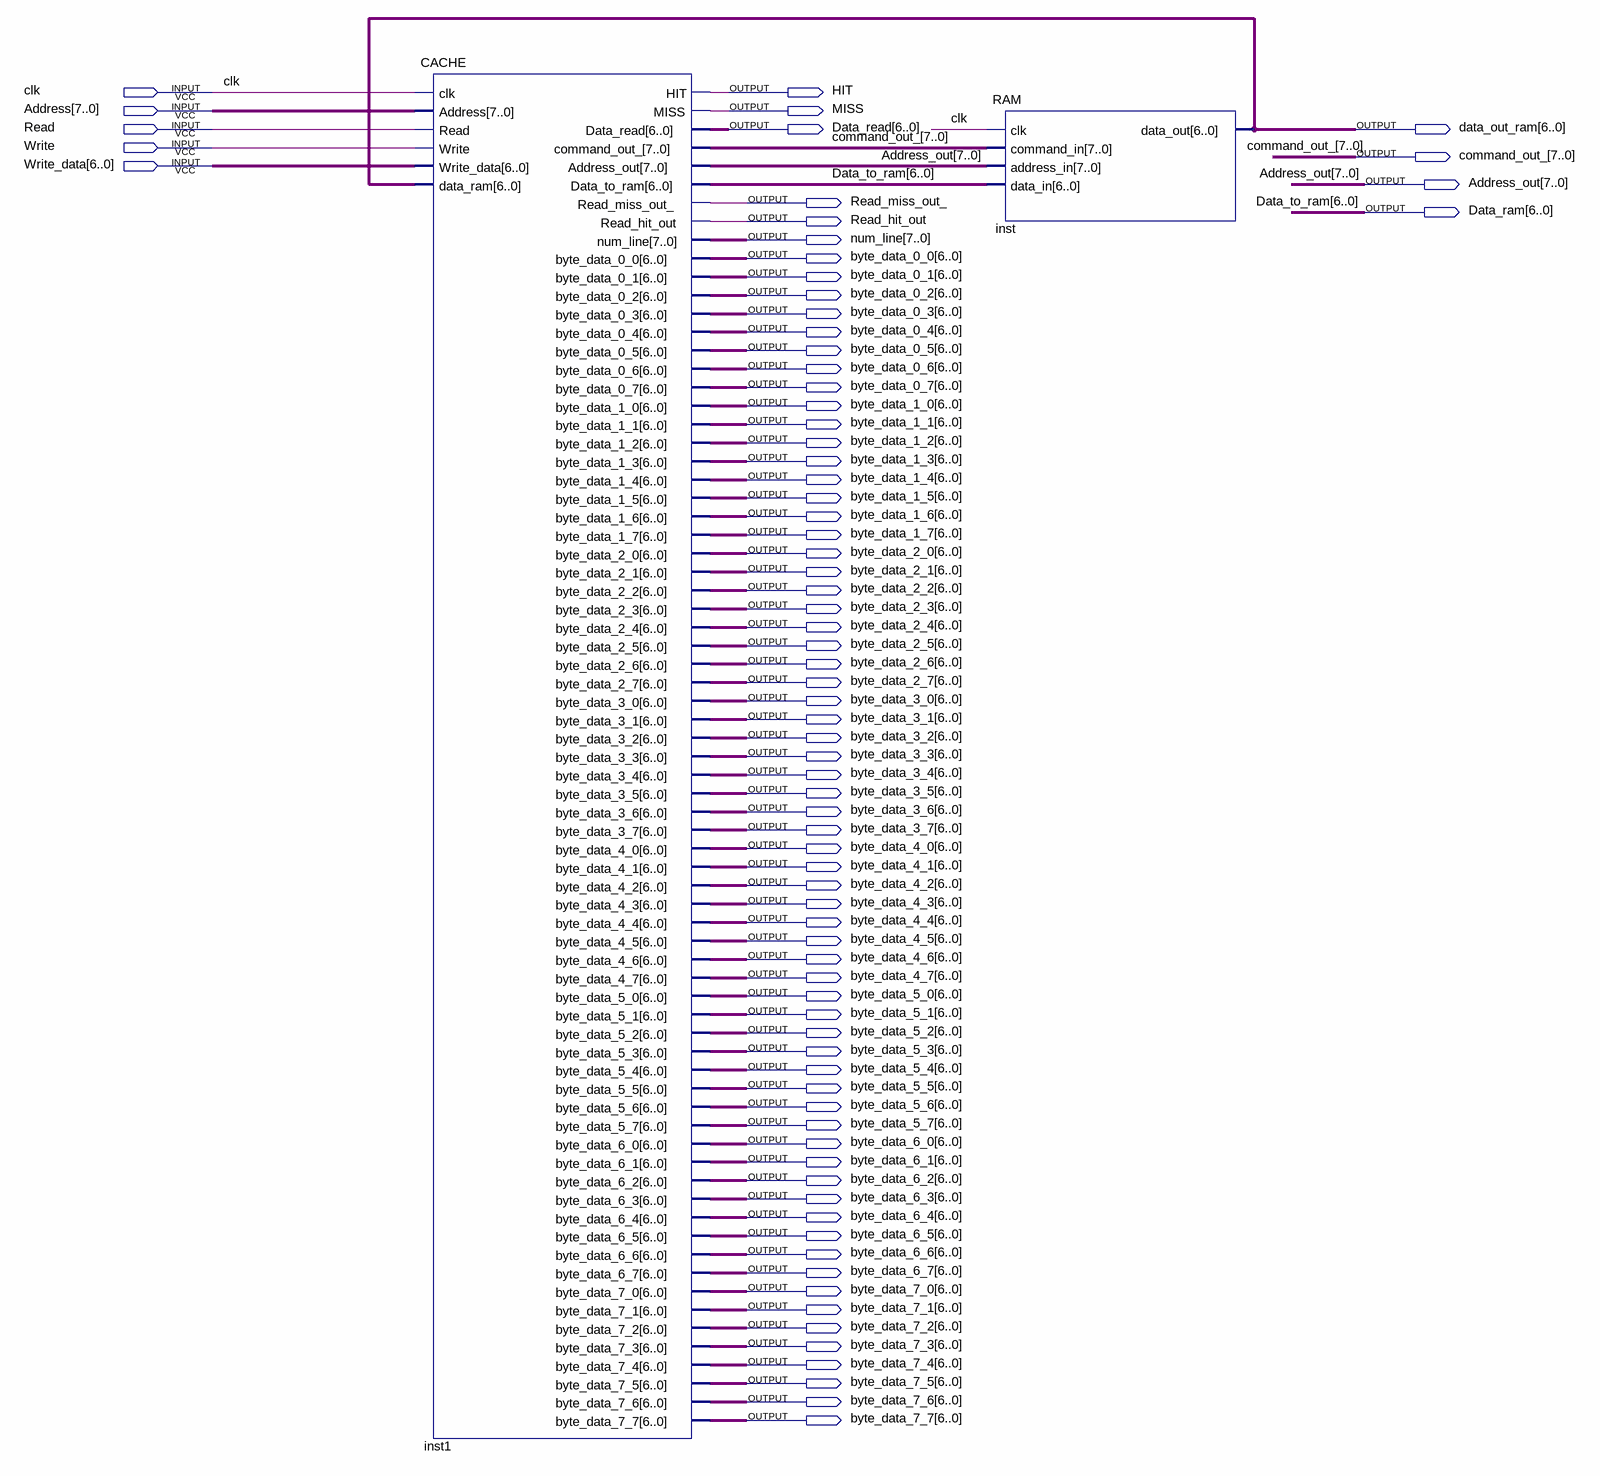
[diagram p0: schematic sheet]
// Quartus schematic lab8.bdf as structural Verilog: 2 symbols, 79 pins
module lab8 (
  input  clk,
  input  [7:0] Address,
  input  Read,
  input  Write,
  input  [6:0] Write_data,
  output HIT,
  output MISS,
  output [6:0] Data_read,
  output [6:0] data_out_ram,
  output [7:0] command_out_,
  output [7:0] Address_out,
  output Read_miss_out_,
  output [6:0] Data_ram,
  output Read_hit_out,
  output [7:0] num_line,
  output [6:0] byte_data_0_0,
  output [6:0] byte_data_0_1,
  output [6:0] byte_data_0_2,
  output [6:0] byte_data_0_3,
  output [6:0] byte_data_0_4,
  output [6:0] byte_data_0_5,
  output [6:0] byte_data_0_6,
  output [6:0] byte_data_0_7,
  output [6:0] byte_data_1_0,
  output [6:0] byte_data_1_1,
  output [6:0] byte_data_1_2,
  output [6:0] byte_data_1_3,
  output [6:0] byte_data_1_4,
  output [6:0] byte_data_1_5,
  output [6:0] byte_data_1_6,
  output [6:0] byte_data_1_7,
  output [6:0] byte_data_2_0,
  output [6:0] byte_data_2_1,
  output [6:0] byte_data_2_2,
  output [6:0] byte_data_2_3,
  output [6:0] byte_data_2_4,
  output [6:0] byte_data_2_5,
  output [6:0] byte_data_2_6,
  output [6:0] byte_data_2_7,
  output [6:0] byte_data_3_0,
  output [6:0] byte_data_3_1,
  output [6:0] byte_data_3_2,
  output [6:0] byte_data_3_3,
  output [6:0] byte_data_3_4,
  output [6:0] byte_data_3_5,
  output [6:0] byte_data_3_6,
  output [6:0] byte_data_3_7,
  output [6:0] byte_data_4_0,
  output [6:0] byte_data_4_1,
  output [6:0] byte_data_4_2,
  output [6:0] byte_data_4_3,
  output [6:0] byte_data_4_4,
  output [6:0] byte_data_4_5,
  output [6:0] byte_data_4_6,
  output [6:0] byte_data_4_7,
  output [6:0] byte_data_5_0,
  output [6:0] byte_data_5_1,
  output [6:0] byte_data_5_2,
  output [6:0] byte_data_5_3,
  output [6:0] byte_data_5_4,
  output [6:0] byte_data_5_5,
  output [6:0] byte_data_5_6,
  output [6:0] byte_data_5_7,
  output [6:0] byte_data_6_0,
  output [6:0] byte_data_6_1,
  output [6:0] byte_data_6_2,
  output [6:0] byte_data_6_3,
  output [6:0] byte_data_6_4,
  output [6:0] byte_data_6_5,
  output [6:0] byte_data_6_6,
  output [6:0] byte_data_6_7,
  output [6:0] byte_data_7_0,
  output [6:0] byte_data_7_1,
  output [6:0] byte_data_7_2,
  output [6:0] byte_data_7_3,
  output [6:0] byte_data_7_4,
  output [6:0] byte_data_7_5,
  output [6:0] byte_data_7_6,
  output [6:0] byte_data_7_7
);

  CACHE inst1 (
    .clk(clk), .Address(Address), .Read(Read), .Write(Write), .Write_data(Write_data),
    .data_ram(data_out_ram), .HIT(HIT), .MISS(MISS), .Data_read(Data_read), .command_out_(command_out_),
    .Address_out(Address_out), .Data_to_ram(Data_ram), .Read_miss_out_(Read_miss_out_),
    .Read_hit_out(Read_hit_out), .num_line(num_line), .byte_data_0_0(byte_data_0_0),
    .byte_data_0_1(byte_data_0_1), .byte_data_0_2(byte_data_0_2), .byte_data_0_3(byte_data_0_3),
    .byte_data_0_4(byte_data_0_4), .byte_data_0_5(byte_data_0_5), .byte_data_0_6(byte_data_0_6),
    .byte_data_0_7(byte_data_0_7), .byte_data_1_0(byte_data_1_0), .byte_data_1_1(byte_data_1_1),
    .byte_data_1_2(byte_data_1_2), .byte_data_1_3(byte_data_1_3), .byte_data_1_4(byte_data_1_4),
    .byte_data_1_5(byte_data_1_5), .byte_data_1_6(byte_data_1_6), .byte_data_1_7(byte_data_1_7),
    .byte_data_2_0(byte_data_2_0), .byte_data_2_1(byte_data_2_1), .byte_data_2_2(byte_data_2_2),
    .byte_data_2_3(byte_data_2_3), .byte_data_2_4(byte_data_2_4), .byte_data_2_5(byte_data_2_5),
    .byte_data_2_6(byte_data_2_6), .byte_data_2_7(byte_data_2_7), .byte_data_3_0(byte_data_3_0),
    .byte_data_3_1(byte_data_3_1), .byte_data_3_2(byte_data_3_2), .byte_data_3_3(byte_data_3_3),
    .byte_data_3_4(byte_data_3_4), .byte_data_3_5(byte_data_3_5), .byte_data_3_6(byte_data_3_6),
    .byte_data_3_7(byte_data_3_7), .byte_data_4_0(byte_data_4_0), .byte_data_4_1(byte_data_4_1),
    .byte_data_4_2(byte_data_4_2), .byte_data_4_3(byte_data_4_3), .byte_data_4_4(byte_data_4_4),
    .byte_data_4_5(byte_data_4_5), .byte_data_4_6(byte_data_4_6), .byte_data_4_7(byte_data_4_7),
    .byte_data_5_0(byte_data_5_0), .byte_data_5_1(byte_data_5_1), .byte_data_5_2(byte_data_5_2),
    .byte_data_5_3(byte_data_5_3), .byte_data_5_4(byte_data_5_4), .byte_data_5_5(byte_data_5_5),
    .byte_data_5_6(byte_data_5_6), .byte_data_5_7(byte_data_5_7), .byte_data_6_0(byte_data_6_0),
    .byte_data_6_1(byte_data_6_1), .byte_data_6_2(byte_data_6_2), .byte_data_6_3(byte_data_6_3),
    .byte_data_6_4(byte_data_6_4), .byte_data_6_5(byte_data_6_5), .byte_data_6_6(byte_data_6_6),
    .byte_data_6_7(byte_data_6_7), .byte_data_7_0(byte_data_7_0), .byte_data_7_1(byte_data_7_1),
    .byte_data_7_2(byte_data_7_2), .byte_data_7_3(byte_data_7_3), .byte_data_7_4(byte_data_7_4),
    .byte_data_7_5(byte_data_7_5), .byte_data_7_6(byte_data_7_6), .byte_data_7_7(byte_data_7_7));
  RAM inst (
    .clk(clk), .command_in(command_out_), .address_in(Address_out), .data_in(Data_ram),
    .data_out(data_out_ram));

  // Other names for the same wires on the sheet: Data_to_ram[6:0] = Data_ram
endmodule
